# EasyEDA schematic KQ rfid reader.json
TITLE: KQ hivemind esp32 reader; REV: 1.1; Date: 2022-05-29; Sheet: 1/1; Company: KQ hive mind
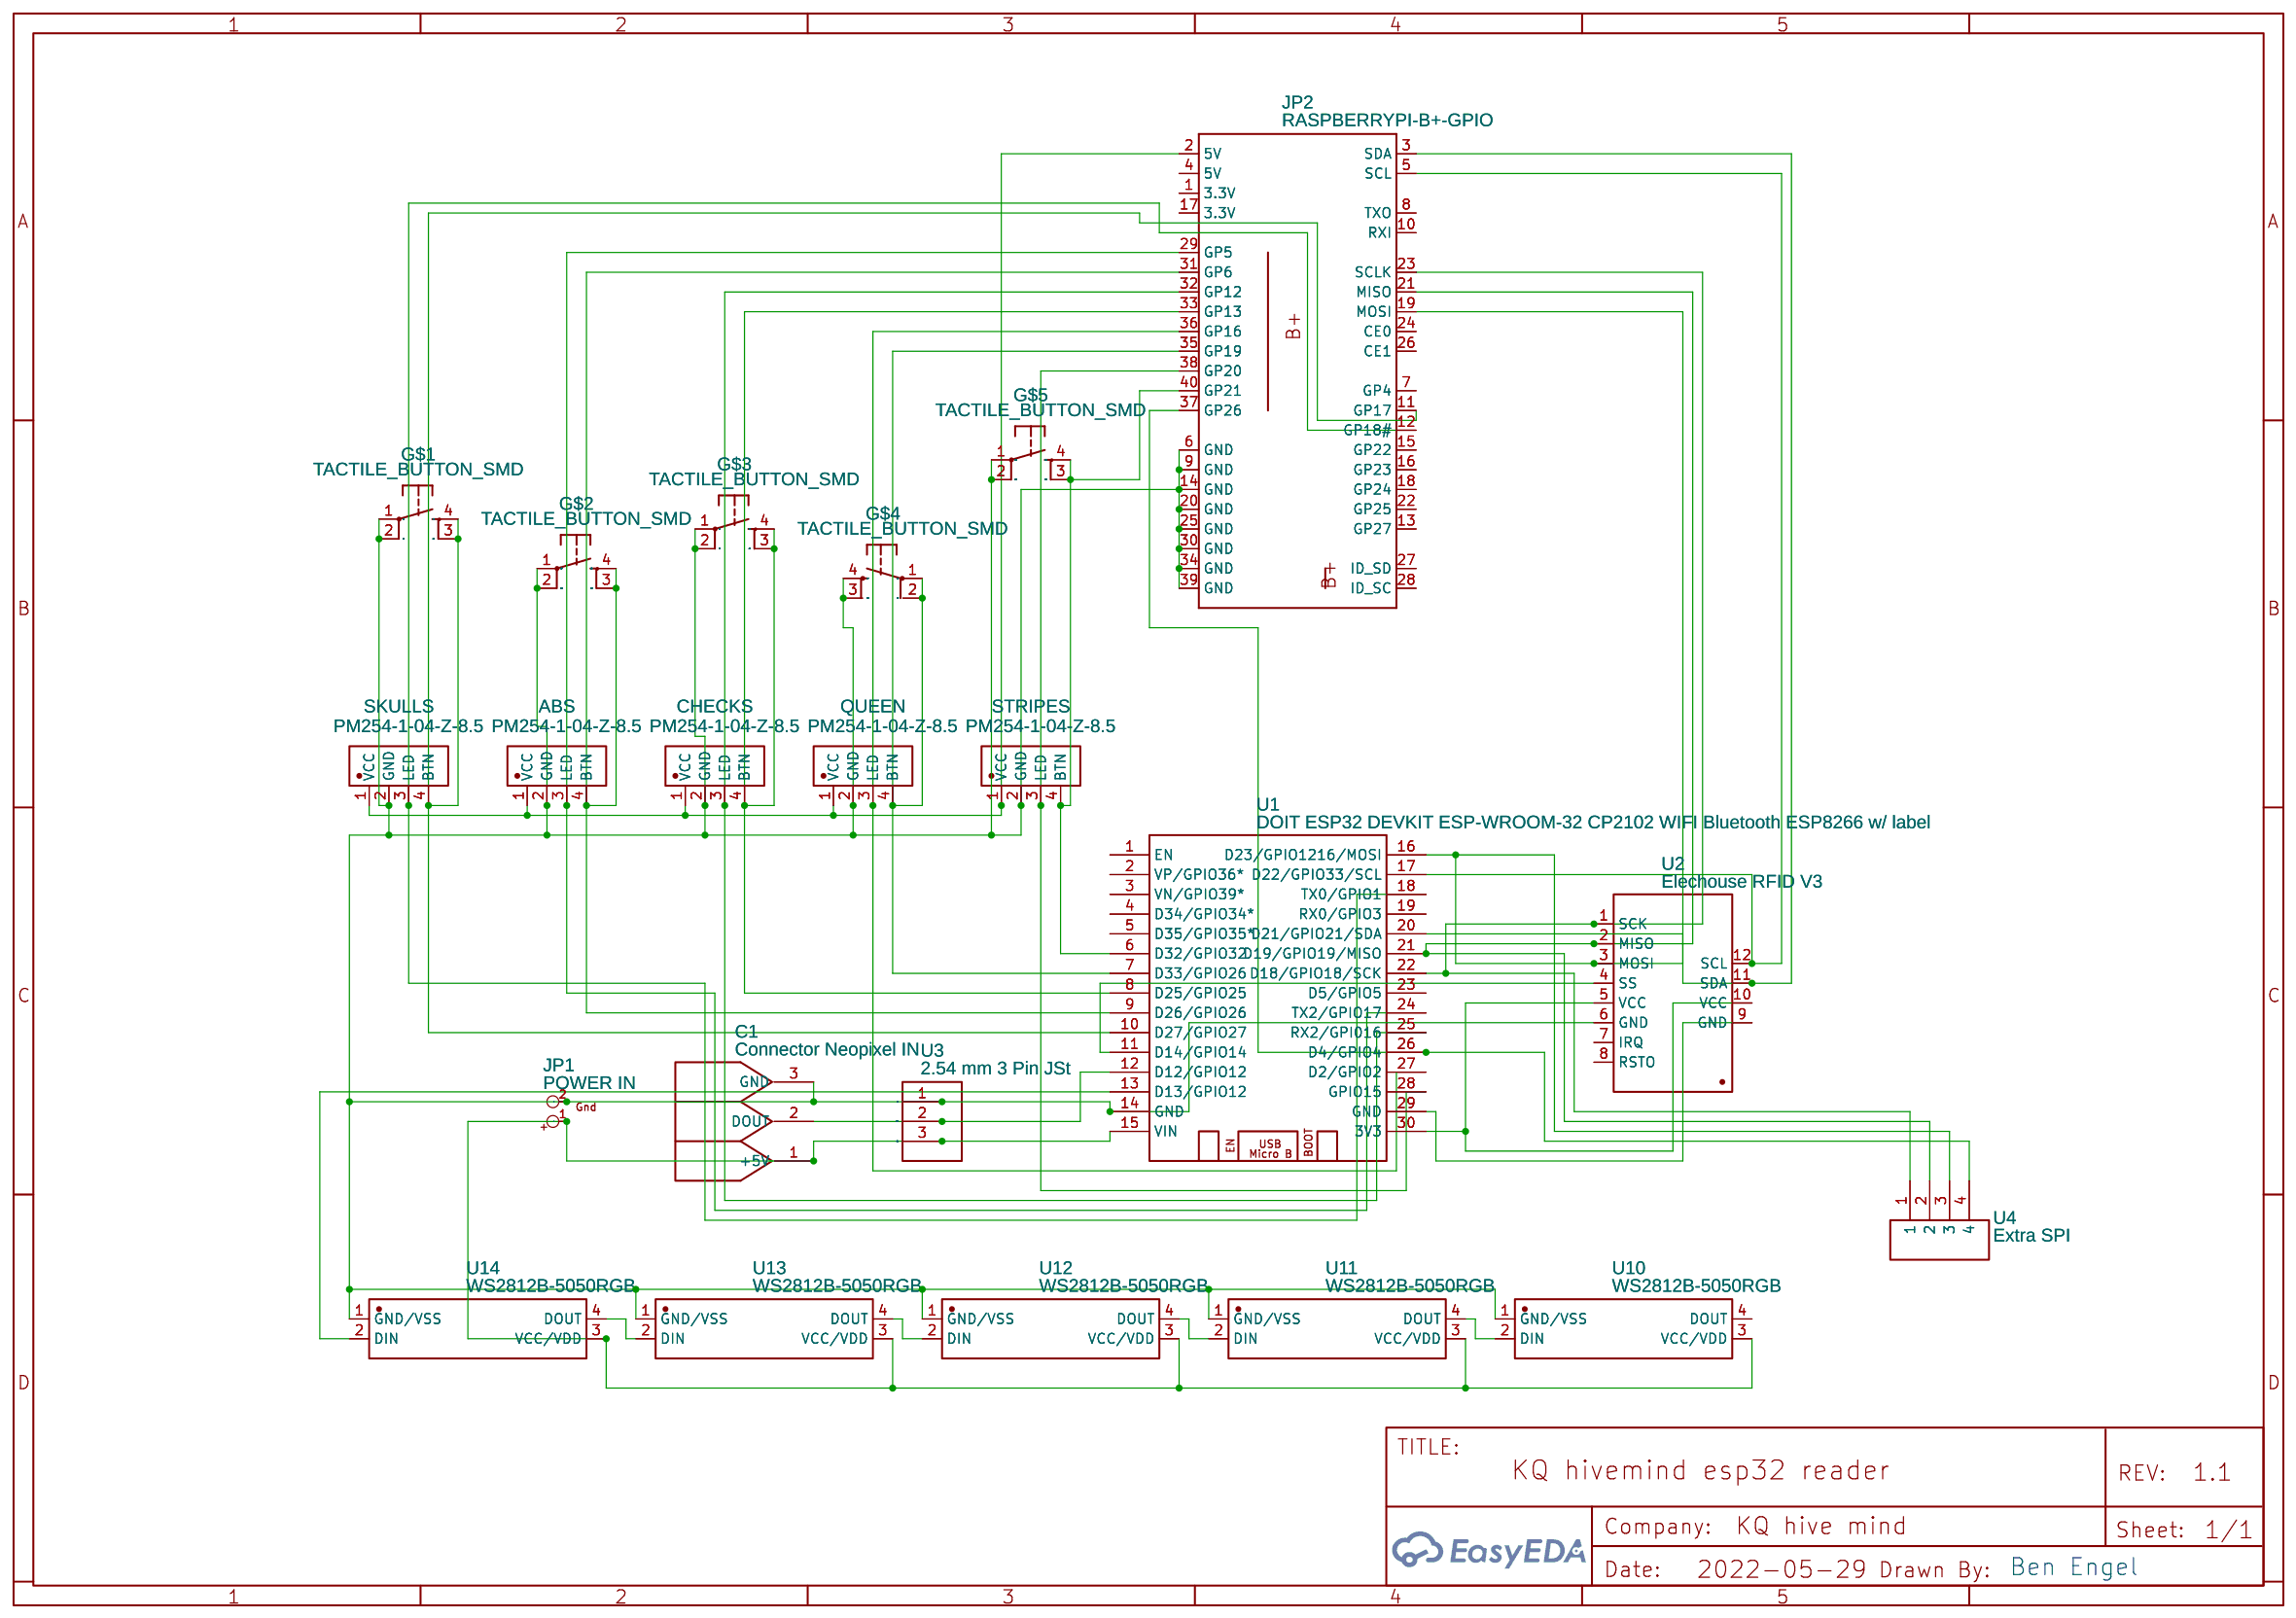
[diagram p0: schematic sheet]

## Parts
ABS  PM254-1-04-Z-8.5  [HDR-TH_4P-P2.54-V-F]
C1  Connector Neopixel IN  [CONNECTOR NEOPIXEL IN]
CHECKS  PM254-1-04-Z-8.5  [HDR-TH_4P-P2.54-V-F]
G$1  TACTILE_BUTTON_SMD  [TACTILE-BUTTON-SMD]
G$2  TACTILE_BUTTON_SMD  [TACTILE-BUTTON-SMD]
G$3  TACTILE_BUTTON_SMD  [TACTILE-BUTTON-SMD]
G$4  TACTILE_BUTTON_SMD  [TACTILE-BUTTON-SMD]
G$5  TACTILE_BUTTON_SMD  [TACTILE-BUTTON-SMD]
JP1  POWER IN  [POWER]
JP2  RASPBERRYPI-B+-GPIO  [2X20-NO SILK]
QUEEN  PM254-1-04-Z-8.5  [HDR-TH_4P-P2.54-V-F]
SKULLS  PM254-1-04-Z-8.5  [HDR-TH_4P-P2.54-V-F]
STRIPES  PM254-1-04-Z-8.5  [HDR-TH_4P-P2.54-V-F]
U1  DOIT ESP32 DEVKIT ESP-WROOM-32 CP2102 WIFI Bluetooth ESP8266 w/ label  [DOIT-ESP32-DEVKIT-V1]
U2  Elechouse RFID V3  [PN532 ELECHOUSE V3 RFID COPY]
U3  2.54 mm 3 Pin JSt  [3PIN_2.54_MM_JST_XHP_JST_CONNECTOR_FOR_DC_SOCKET]
U4  Extra SPI  [1X4 PIN HEADERS]
U10  WS2812B-5050RGB  [LED-SMD_4P-L5.0-W5.0-BR_WS2812B-5050RGB]
U11  WS2812B-5050RGB  [LED-SMD_4P-L5.0-W5.0-BR_WS2812B-5050RGB]
U12  WS2812B-5050RGB  [LED-SMD_4P-L5.0-W5.0-BR_WS2812B-5050RGB]
U13  WS2812B-5050RGB  [LED-SMD_4P-L5.0-W5.0-BR_WS2812B-5050RGB]
U14  WS2812B-5050RGB  [LED-SMD_4P-L5.0-W5.0-BR_WS2812B-5050RGB]

## Library data of the parts
ABS CHECKS QUEEN SKULLS STRIPES = PM254-1-04-Z-8.5: Supplier: LCSC; Supplier Part: C2897367; Manufacturer: HCTL(华灿天禄); Contributor: LCSC; JLCPCB Part Class: Extended Part
C1 = Connector Neopixel IN: Manufacturer: Marco; Contributor: mlch
G$1-G$5 = TACTILE_BUTTON_SMD: Contributor: calimero2312
JP1 = POWER IN: PIN HEADER; Contributor: Adafruit; sourceId: i5d7pHZhZ
JP2 = RASPBERRYPI-B+-GPIO: Raspberry Pi B+ GPIO Header; Contributor: SparkFun
U1 = DOIT ESP32 DEVKIT ESP-WROOM-32 CP2102 WIFI Bluetooth ESP8266 w/ label: Contributor: Qi Chen; Supplier: Ali Express; link: https://pt.aliexpress.com/item/32842731763.html
U2 = Elechouse RFID V3: Manufacturer: Elechouse; Contributor: rohimfikri
U3 = 2.54 mm 3 Pin JSt: Contributor: avva.saipranav
U4 = 1X4 PIN HEADER: Manufacturer Part: 1x2 Pin Header; Contributor: WooDFox
U10-U14 = WS2812B-5050RGB: Supplier: LCSC; Supplier Part: C2838584; Manufacturer: null; JLCPCB Part Class: Extended Part; Contributor: benengel94

## Nets
Net-(ABS-1): ABS.1(VCC) CHECKS.1(VCC) JP2.2(5V) QUEEN.1(VCC) SKULLS.1(VCC) STRIPES.1(VCC)
Net-(ABS-2): ABS.2(GND) C1.3(GND) CHECKS.2(GND) G$1.1(SWA1) G$1.2(SWB1) G$2.1(SWA1) G$2.2(SWB1) G$3.1(SWA1) G$3.2(SWB1) G$4.3(SWB2) G$4.4(SWA2) G$5.1(SWA1) G$5.2(SWB1) JP1.2(-) JP2.6(GND) JP2.9(GND) JP2.14(GND) JP2.20(GND) JP2.25(GND) JP2.30(GND) JP2.34(GND) JP2.39(GND) QUEEN.2(GND) SKULLS.2(GND) STRIPES.2(GND) U1.14(GND) U2.6(GND) U3.1(PIN) U10.1(GND/VSS) U11.1(GND/VSS) U12.1(GND/VSS) U13.1(GND/VSS) U14.1(GND/VSS)
Net-(ABS-3): ABS.3(LED) JP2.29(GP5) U1.24(TX2/GPIO17)
Net-(ABS-4): ABS.4(BTN) G$2.3(SWB2) G$2.4(SWA2) JP2.31(GP6) U1.9(D26/GPIO26)
Net-(C1-1): C1.1(+5V) JP1.1(+) U1.15(VIN) U3.3(OUTER) U10.3(VCC/VDD) U11.3(VCC/VDD) U12.3(VCC/VDD) U13.3(VCC/VDD) U14.3(VCC/VDD)
Net-(C1-2): C1.2(DOUT) U1.12(D12/GPIO12) U3.2(SWITCH)
Net-(CHECKS-3): CHECKS.3(LED) JP2.32(GP12) U1.25(RX2/GPI016)
Net-(CHECKS-4): CHECKS.4(BTN) G$3.3(SWB2) G$3.4(SWA2) JP2.33(GP13) U1.8(D25/GPIO25)
Net-(G$1-3): G$1.3(SWB2) G$1.4(SWA2) JP2.11(GP17) SKULLS.4(BTN) U1.10(D27/GPIO27)
Net-(G$4-1): G$4.1(SWA1) G$4.2(SWB1) JP2.35(GP19) QUEEN.4(BTN) U1.7(D33/GPIO26)
Net-(G$5-3): G$5.3(SWB2) G$5.4(SWA2) JP2.40(GP21) STRIPES.4(BTN) U1.6(D32/GPIO32)
Net-(JP2-3): JP2.3(SDA) U1.20(D21/GPIO21/SDA) U2.11(SDA)
Net-(JP2-5): JP2.5(SCL) U1.17(D22/GPIO33/SCL) U2.12(SCL)
Net-(JP2-12): JP2.12(GP18#) SKULLS.3(LED) U1.18(TX0/GPIO1)
Net-(JP2-19): JP2.19(MOSI) U1.16(D23/GPIO1216/MOSI) U2.3(MOSI) U4.3
Net-(JP2-21): JP2.21(MISO) U1.21(D19/GPIO19/MISO) U2.2(MISO) U4.2
Net-(JP2-23): JP2.23(SCLK) U1.22(D18/GPIO18/SCK) U2.1(SCK) U4.1
Net-(JP2-36): JP2.36(GP16) QUEEN.3(LED) U1.27(D2/GPIO2)
Net-(JP2-37): JP2.37(GP26) U1.26(D4/GPIO4) U4.4
Net-(JP2-38): JP2.38(GP20) STRIPES.3(LED) U1.28(GPIO15)
Net-(U1-11): U1.11(D14/GPIO14) U2.4(SS)
Net-(U1-13): U1.13(D13/GPIO12) U14.2(DIN)
Net-(U1-29): U1.29(GND) U2.9(GND)
Net-(U1-30): U1.30(3V3) U2.5(VCC) U2.10(VCC)
Net-(U10-2): U10.2(DIN) U11.4(DOUT)
Net-(U11-2): U11.2(DIN) U12.4(DOUT)
Net-(U12-2): U12.2(DIN) U13.4(DOUT)
Net-(U13-2): U13.2(DIN) U14.4(DOUT)

Not connected (* = marked no-connect by the designer): JP2 1(3.3V) 4(5V) 7(GP4) 8(TXO) 10(RXI) 13(GP27) 15(GP22) 16(GP23) 17(3.3V) 18(GP24) 22(GP25) 24(CE0) 26(CE1) 27(ID_SD) 28(ID_SC); U1 1(EN) 2(VP/GPIO36*) 3(VN/GPIO39*) 4(D34/GPIO34*) 5(D35/GPIO35*) 19(RX0/GPIO3) 23(D5/GPIO5); U2 7(IRQ) 8(RSTO); U10 4(DOUT)

## Notes on the sheet
- Ben Engel
